# EAGLE design max-night (EAGLE 6.5.0)
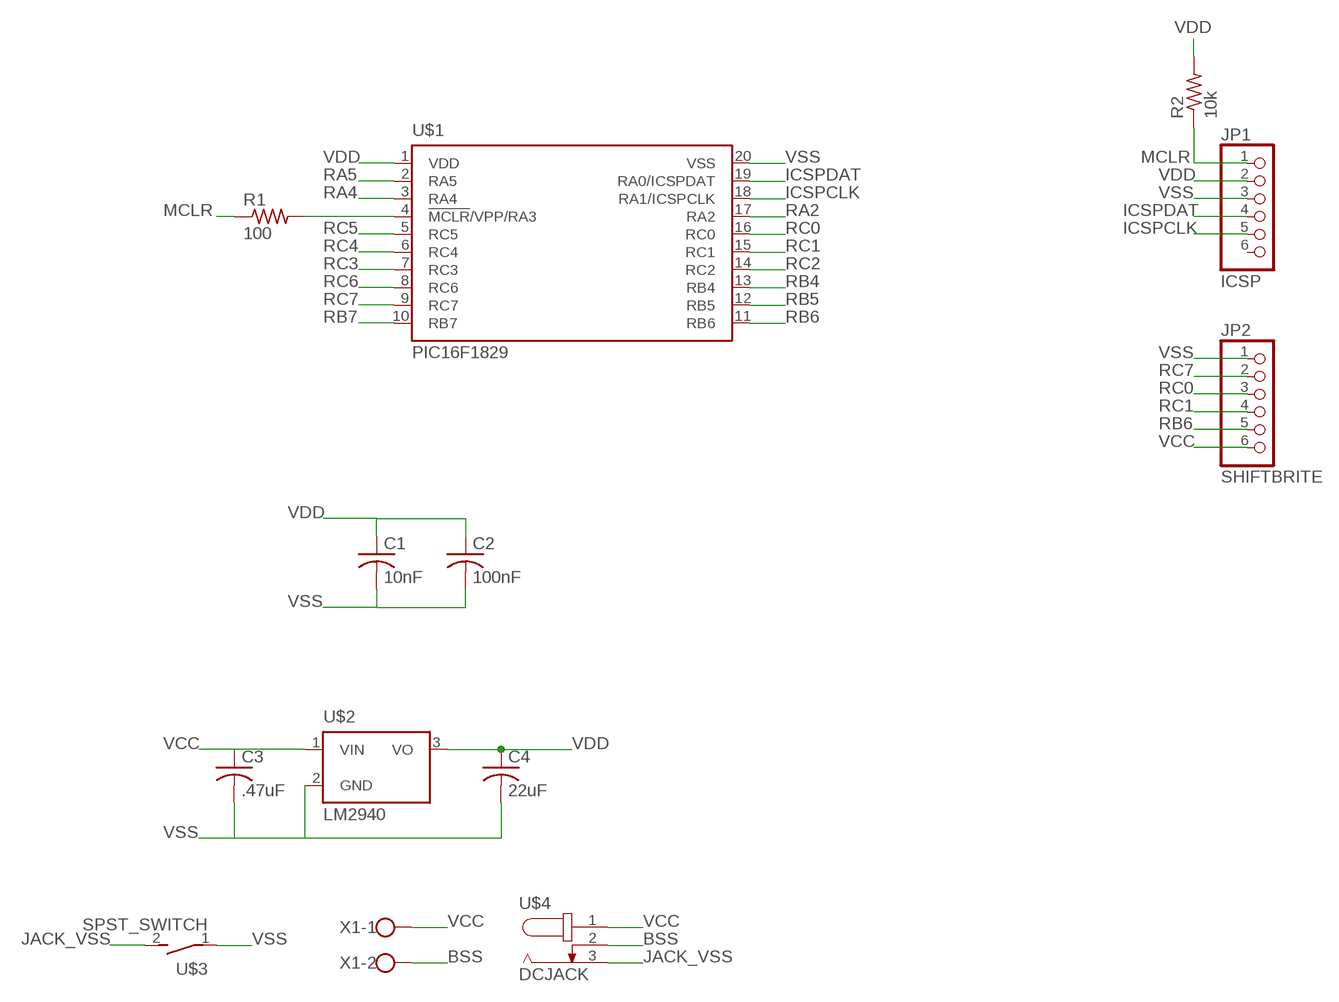
[diagram p0: schematic, sheet 1]

## Parts
C1  10nF  C-US050-035X075  [C050-035X075]
C2  100nF  C-US050-035X075  [C050-035X075]
C3  .47uF  C-US050-035X075  [C050-035X075]
C4  22uF  C-US050-035X075  [C050-035X075]
JP1  ICSP  PINHD-1X6  [1X06]
JP2  SHIFTBRITE  PINHD-1X6  [1X06]
R1  100  R-US_0309/12  [0309/12]
R2  10k  R-US_0309/12  [0309/12]
U$1  PIC16F1829  [DIL20]
U$2  LM2940  [TO220V]
U$3  SPST_SWITCH  [SWITCH_SPST]
U$4  DCJACK  [DCJACKFP]
X1  W237-102  [W237-102]

## Nets
BSS: U$4.2 X1.2
ICSPCLK: JP1.5 U$1.18(RA1/ICSPCLK)
ICSPDAT: JP1.4 U$1.19(RA0/ICSPDAT)
JACK_VSS: U$3.2(S) U$4.3
MCLR: JP1.1 R1.1 R2.1
N$1: R1.2 U$1.4(!MCLR!/VPP/RA3)
RA2: U$1.17(RA2)
RA4: U$1.3(RA4)
RA5: U$1.2(RA5)
RB4: U$1.13(RB4)
RB5: U$1.12(RB5)
RB6: JP2.5 U$1.11(RB6)
RB7: U$1.10(RB7)
RC0: JP2.3 U$1.16(RC0)
RC1: JP2.4 U$1.15(RC1)
RC2: U$1.14(RC2)
RC3: U$1.7(RC3)
RC4: U$1.6(RC4)
RC5: U$1.5(RC5)
RC6: U$1.8(RC6)
RC7: JP2.2 U$1.9(RC7)
VCC: C3.1 JP2.6 U$2.1(VIN) U$4.1 X1.1
VDD: C1.1 C2.1 C4.1 JP1.2 R2.2 U$1.1(VDD) U$2.3(VO)
VSS: C1.2 C2.2 C3.2 C4.2 JP1.3 JP2.1 U$1.20(VSS) U$2.2(GND) U$3.1(P)
Unconnected: JP1.6

## Library data of the parts
C1-C4 = rcl:C-US: CAPACITOR, American symbol
JP1 JP2 = pinhead:PINHD-1X6: PIN HEADER
R1 R2 = rcl:R-US_: RESISTOR, American symbol
U$1 = fritz:PIC16F1829: PIC16f1829 http://ww1.microchip.com/downloads/en/DeviceDoc/41440C.pdf
U$2 = fritz:LM2940: TI LM2940 5V LDO Regulator http://www.mouser.com/ds/2/282/snvs769h-187242.pdf
U$3 = fritz:SPST_SWITCH
U$4 = fritz:DCJACK
X1 = con-wago-500:W237-102: WAGO SCREW CLAMP; MPN: 237-102; OC_FARNELL: unknown; OC_NEWARK: 70K9898

## Net classes
0 default: clearance 0.205 mm

## Board
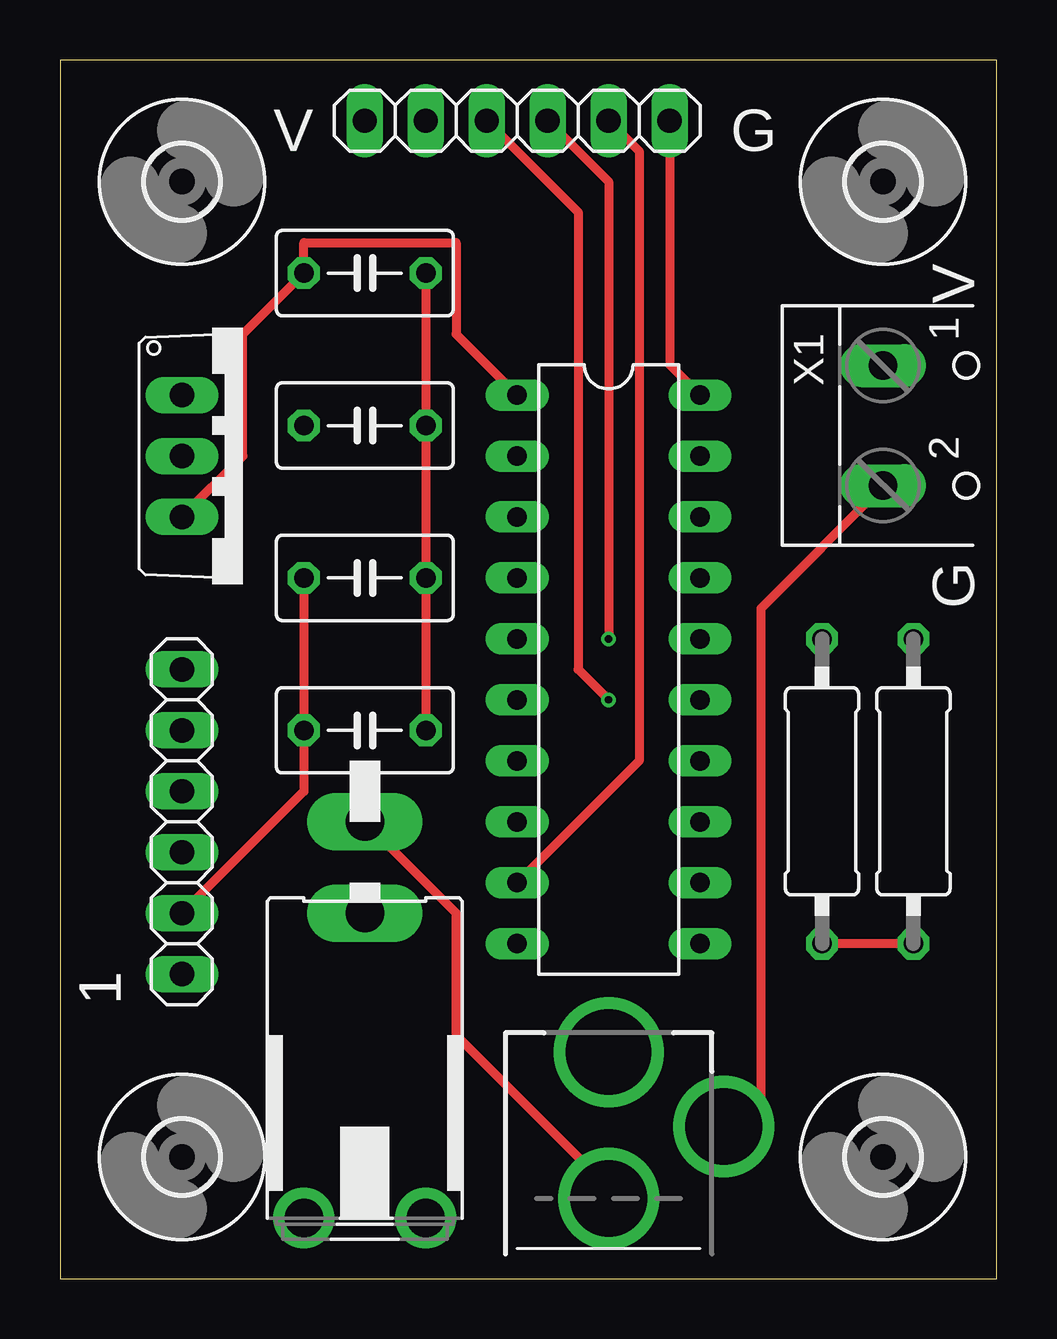
[diagram p1: board, top side]
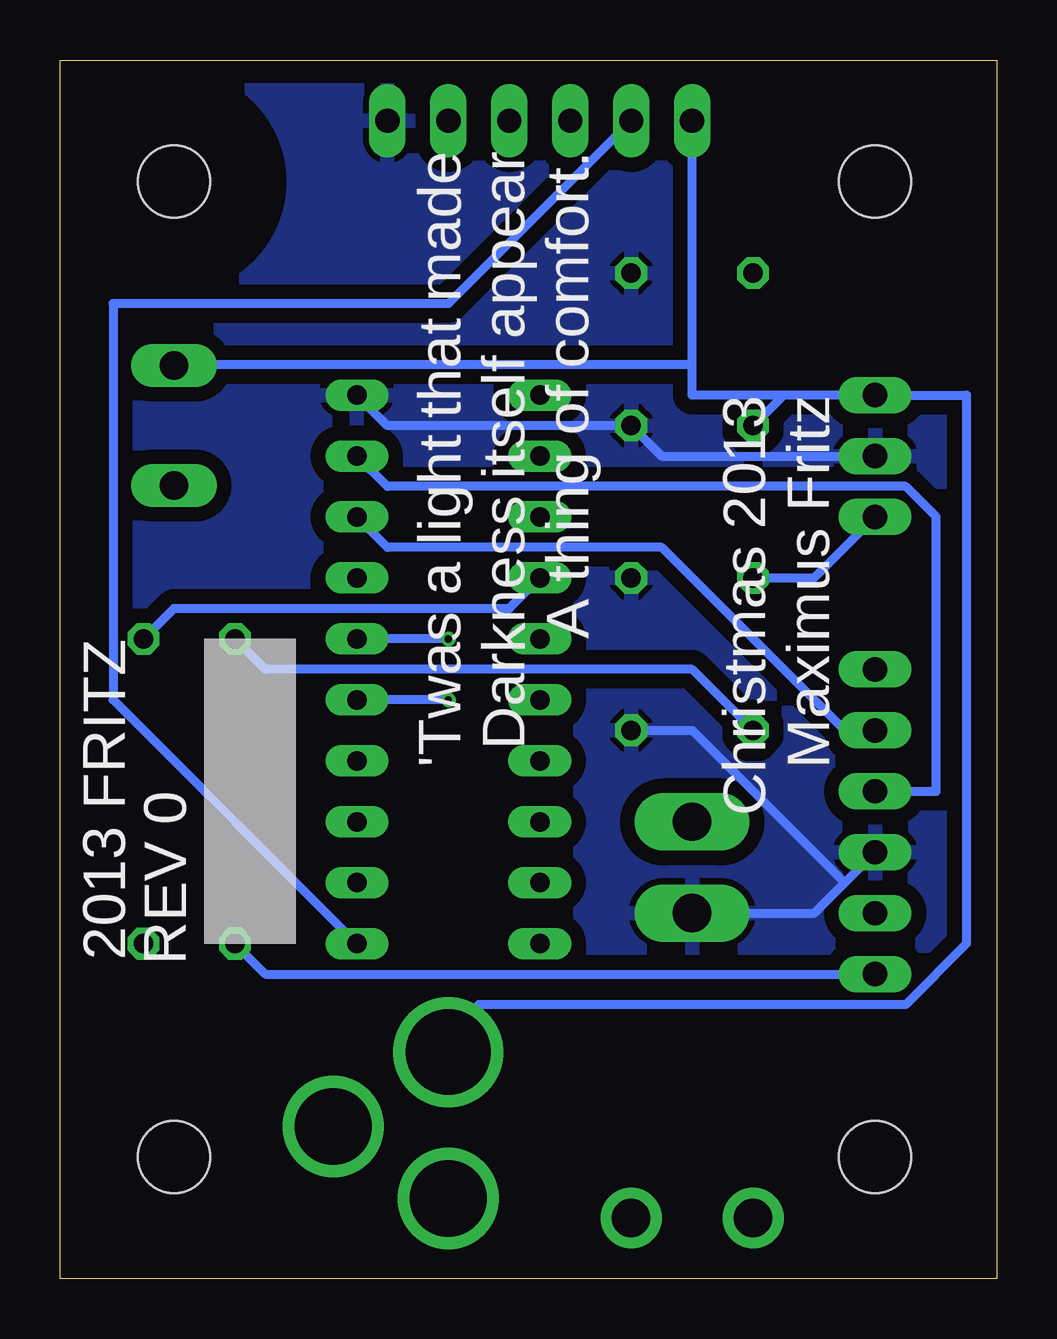
[diagram p2: board, bottom side, seen from below]

Size 39.04 x 50.79 mm. Coordinates in mm from the lower left corner, seen from the top.
Outline: 0,0 39.04,0 39.04,50.79 0,50.79 0,0
Copper layers (1*16): Top 0.035mm / dielectric 1.5mm / Bottom 0.035mm
Design rules "ITEADstudio_DRC": minimum track width 6mil, minimum drill 12mil, track to track 6mil, track to pad 6mil, pad to pad 6mil, via to via 6mil, smd to smd 0mil, copper to edge 10mil, drill to drill 10mil, minimum pad ring 10mil, minimum via ring 6mil, stop-mask expansion 2mil, vias tented up to drill 100mil, thermal gap 10mil

### Footprints (pad centres in the part's own frame; a part is rotated, then mirrored left to right if it is on the bottom)
C050-035X075 = drill 0.813 octagon: 1 -2.54,0; 2 2.54,0
1X06 = drill 1.016 long: 1 -6.35,0; 2 -3.81,0; 3 -1.27,0; 4 1.27,0; 5 3.81,0; 6 6.35,0
0309/12 = drill 0.813 octagon: 1 -6.35,0; 2 6.35,0
DIL20 = drill 0.813 long: 1 -11.43,-3.81; 2 -8.89,-3.81; 3 -6.35,-3.81; 4 -3.81,-3.81; 5 -1.27,-3.81; 6 1.27,-3.81; 7 3.81,-3.81; 8 6.35,-3.81; 9 8.89,-3.81; 10 11.43,-3.81; 11 11.43,3.81; 12 8.89,3.81; 13 6.35,3.81; 14 3.81,3.81; 15 1.27,3.81; 16 -1.27,3.81; 17 -3.81,3.81; 18 -6.35,3.81; 19 -8.89,3.81; 20 -11.43,3.81
TO220V = drill 1.016 long: 1 -2.54,1.27; 2 0,1.27; 3 2.54,1.27
SWITCH_SPST = drill 1.6 long: 1 0,6.35; 2 0,10.16 | drill 1.6 pad 2.54: B -2.54,-6.35; B1 2.54,-6.35
DCJACKFP = drill 3.556 pad 4.318: 1 0,5.64 | drill 3.2 pad 3.81: 2 4.8,2.54; 3 0,-0.46
3,0 = hole 3: 0,0
W237-102 = drill 1.194 long: 1 -2.5,-1.27; 2 2.5,-1.27

### Placement (x,y rotation side)
C1  12.7,22.86 0 top
C2  12.7,29.21 0 top
C3  12.7,35.56 0 top
C4  12.7,41.91 0 top
JP1  5.08,19.05 90 top
JP2  19.05,48.26 180 top
R1  35.56,20.32 90 top
R2  31.75,20.32 90 top
U$1  22.86,25.4 270 top
U$2  3.81,34.29 270 top
U$3  12.7,8.89 0 top
U$4  22.86,3.81 0 top
U$5  [3,0]  5.08,45.72 0 top
U$6  [3,0]  34.29,45.72 0 top
U$7  [3,0]  34.29,5.08 0 top
U$8  [3,0]  5.08,5.08 0 top
X1  35.56,35.56 270 top

### Tracks (layer width: path | path; a pad name or v marks a point on that pad's centre or on a via)
BSS
  Top 0.381: X1.2 34.29,33.02 29.21,27.94 29.21,7.62 27.94,6.35 U$4.2
ICSPCLK
  Bottom 0.381: U$1.18 25.4,30.48 13.97,30.48 6.35,22.86 JP1.5
ICSPDAT
  Bottom 0.381: U$1.19 25.4,33.02 3.81,33.02 2.54,31.75 2.54,20.32 JP1.4
JACK_VSS
  Top 0.381: U$3.2 16.51,15.24 16.51,10.16 22.86,3.81 U$4.3
MCLR
  Top 0.381: R1.1 R2.1
  Bottom 0.381: JP1.1 30.48,12.7 R2.1
N$1
  Bottom 0.381: U$1.4 20.32,27.94 34.29,27.94 R1.2
RB6
  Bottom 0.381: U$1.11 36.83,24.13 36.83,40.64 22.86,40.64 JP2.5
RC0  (via drill 0.3)
  Top 0.381: v22.86,26.67 22.86,45.72 JP2.3
  Bottom 0.381: v22.86,26.67 U$1.16
RC1  (via drill 0.3)
  Top 0.381: v22.86,24.13 21.59,25.4 21.59,44.45 JP2.4
  Bottom 0.381: v22.86,24.13 U$1.15
RC7
  Top 0.381: U$1.9 24.13,21.59 24.13,46.99 JP2.2
VCC
  Bottom 0.381: 8.89,36.83 C3.1 | 8.89,36.83 U$2.1 1.27,36.83 1.27,13.97 3.81,11.43 21.59,11.43 22.86,10.16 U$4.1 | 12.7,38.1 12.7,36.83 8.89,36.83 | 12.7,38.1 JP2.6 | 12.7,38.1 34.29,38.1 X1.1
VDD
  Top 0.381: U$2.3 7.62,34.29 7.62,39.37 C4.1 10.16,43.18 16.51,43.18 16.51,39.37 U$1.1 | C2.1 C1.1 10.16,20.32 JP1.2
  Bottom 0.381: R2.2 30.48,25.4 12.7,25.4 C1.1 | U$2.3 7.62,29.21 C2.1
VSS
  Top 0.381: U$1.20 25.4,38.1 JP2.1 | C1.2 C2.2 C3.2 C4.2
  Bottom 0.381: 6.35,16.51 7.62,15.24 U$3.1 | 6.35,16.51 JP1.3 | U$2.2 13.97,34.29 C3.2 25.4,35.56 U$1.20 | 6.35,16.51 12.7,22.86 C1.2
  pour Bottom (isolate 0.61): 1.27,49.53 1.27,1.27 38.1,1.27 38.1,49.53

### Text on the board
tNames: V | G | V | G | 1
bNames: 'Twas a light that made / Darkness itself appear / A thing of comfort. | Christmas 2013 / Maximus Fritz | 2013 FRITZ | REV 0